# Altium schematic sheet micro-circuit-ATMEGA32M1.SchDoc: ATMega32M1 Circuit
size A4; DrawnBy: Dylan Vogel; Organization: UTAT SS; Revision: 1.0
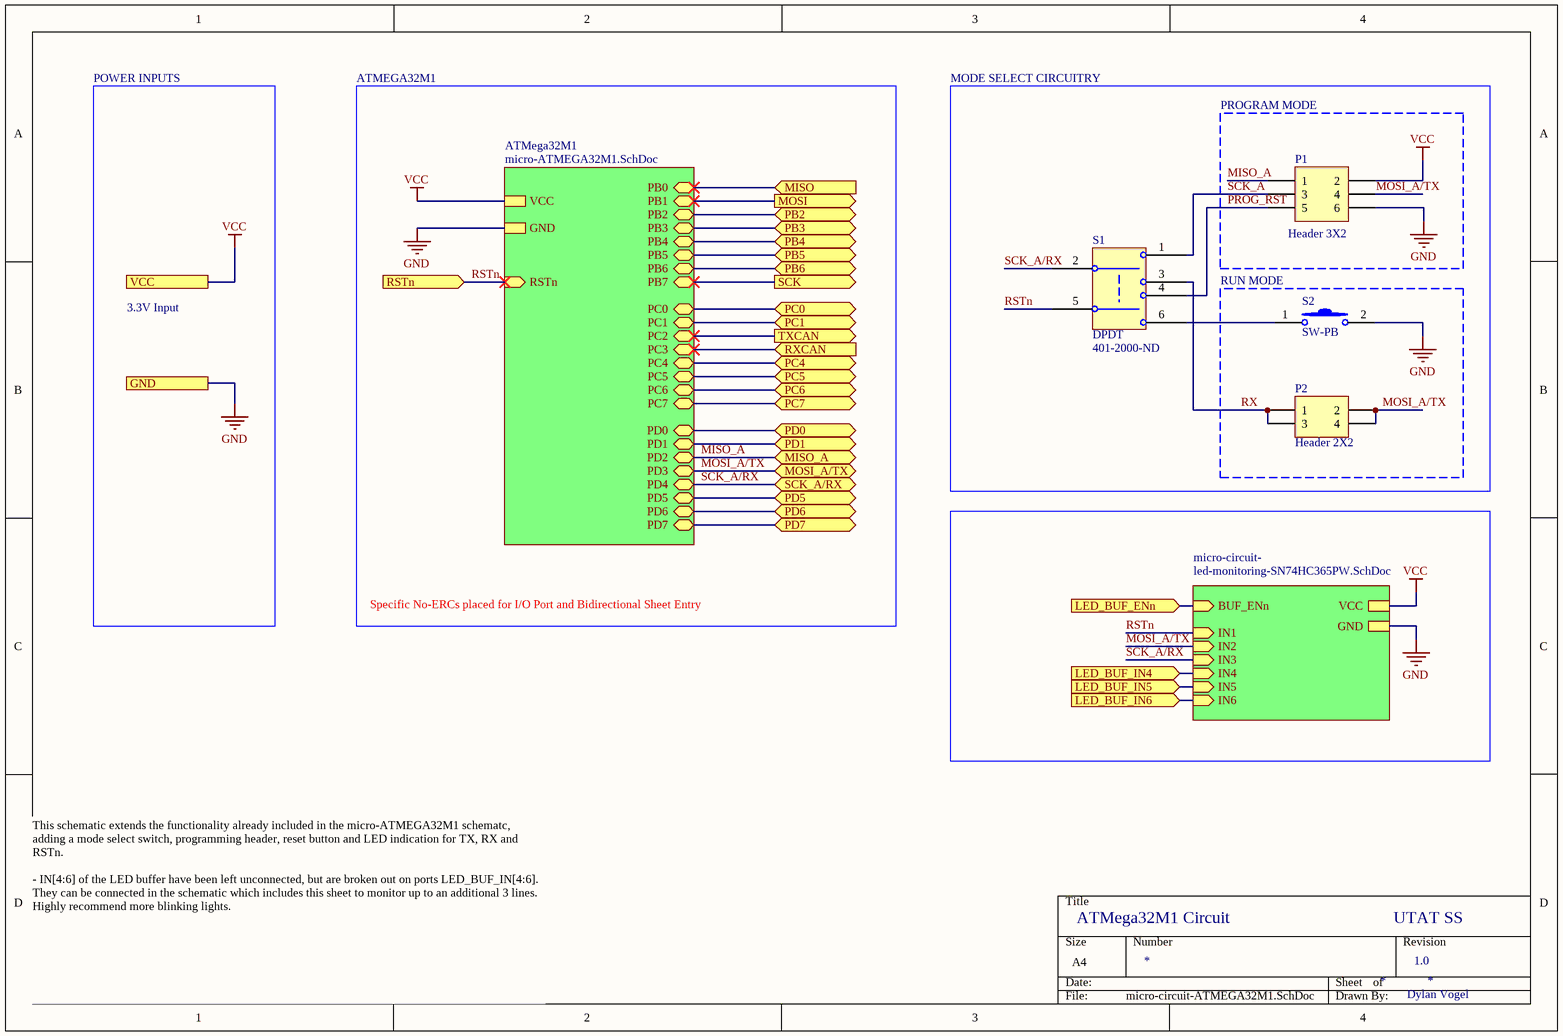
[diagram p0: micro-circuit-ATMEGA32M1.SchDoc]

## Parts
P1  Header 3X2  [HDR2X3]
P2  Header 2X2  [HDR2X2]
S1  DPDT  Supplier Part Number 1: 401-2000-ND  [JS202011AQN - Slide Switch]
S2  SW-PB  [PTS830GM140 SMTR LFS - Pushbutton]

## Blocks framed on the sheet
MODE SELECT CIRCUITRY: S1
PROGRAM MODE: P1
RUN MODE: P2 S2

## Sub-sheets
ATMega32M1 = micro-ATMEGA32M1.SchDoc: GND, PB7 (bidir), RSTn (in), VCC, PD2 (bidir), PC0 (bidir), PD1 (bidir), PD3 (bidir), PD0 (bidir), PC7 (bidir), PD5 (bidir), PC1 (bidir), PC6 (bidir), PB1 (bidir), PB6 (bidir), PC5 (bidir), PC2 (bidir), PB5 (bidir), PC3 (bidir), PD7 (bidir), PB4 (bidir), PB0 (bidir), PC4 (bidir), PD6 (bidir), PB2 (bidir), PB3 (bidir), PD4 (bidir)
micro-circuit- = led-monitoring-SN74HC365PW.SchDoc: IN4 (in), VCC, IN3 (in), IN1 (in), GND, IN2 (in), IN6 (in), IN5 (in), BUF_ENn (in)  | LED1: GREEN LED; LED2: ORANGE LED; LED3: ORANGE LED

## Ports
GND, LED_BUF_ENn (in), LED_BUF_IN4 (in), LED_BUF_IN5 (in), LED_BUF_IN6 (in), MISO (in), MISO_A (bidir), MOSI (out), MOSI_A/TX (bidir), PB2 (bidir), PB3 (bidir), PB4 (bidir), PB5 (bidir), PB6 (bidir), PC0 (bidir), PC1 (bidir), PC4 (bidir), PC5 (bidir), PC6 (bidir), PC7 (bidir), PD0 (bidir), PD1 (bidir), PD5 (bidir), PD6 (bidir), PD7 (bidir), RSTn (in), RXCAN (in), SCK (out), SCK_A/RX (bidir), TXCAN (out), VCC

## Nets
GND: P1.6 S2.2 ; port GND, sheet ATMega32M1/GND, sheet micro-circuit-/GND
VCC: P1.2 ; port VCC, sheet ATMega32M1/VCC, sheet micro-circuit-/VCC
LED_BUF_ENn: port LED_BUF_ENn, sheet micro-circuit-/BUF_ENn
LED_BUF_IN4: port LED_BUF_IN4, sheet micro-circuit-/IN4
LED_BUF_IN5: port LED_BUF_IN5, sheet micro-circuit-/IN5
LED_BUF_IN6: port LED_BUF_IN6, sheet micro-circuit-/IN6
MISO: port MISO, sheet ATMega32M1/PB0
MISO_A: P1.1 ; port MISO_A, sheet ATMega32M1/PD2
MOSI: port MOSI, sheet ATMega32M1/PB1
MOSI_A/TX: P1.4 P2.2 P2.4 ; port MOSI_A/TX, sheet ATMega32M1/PD3, sheet micro-circuit-/IN2
PB2: port PB2, sheet ATMega32M1/PB2
PB3: port PB3, sheet ATMega32M1/PB3
PB4: port PB4, sheet ATMega32M1/PB4
PB5: port PB5, sheet ATMega32M1/PB5
PB6: port PB6, sheet ATMega32M1/PB6
PC0: port PC0, sheet ATMega32M1/PC0
PC1: port PC1, sheet ATMega32M1/PC1
PC4: port PC4, sheet ATMega32M1/PC4
PC5: port PC5, sheet ATMega32M1/PC5
PC6: port PC6, sheet ATMega32M1/PC6
PC7: port PC7, sheet ATMega32M1/PC7
PD0: port PD0, sheet ATMega32M1/PD0
PD1: port PD1, sheet ATMega32M1/PD1
PD5: port PD5, sheet ATMega32M1/PD5
PD6: port PD6, sheet ATMega32M1/PD6
PD7: port PD7, sheet ATMega32M1/PD7
PROG_RST: P1.5 S1.4(POLE2A)
RSTn: S1.5(POLE2) ; port RSTn, sheet ATMega32M1/RSTn, sheet micro-circuit-/IN1
RX: P2.1 P2.3 S1.3(POLE1B)
RXCAN: port RXCAN, sheet ATMega32M1/PC3
SCK: port SCK, sheet ATMega32M1/PB7
SCK_A: P1.3 S1.1(POLE1A)
SCK_A/RX: S1.2(POLE1) ; port SCK_A/RX, sheet ATMega32M1/PD4, sheet micro-circuit-/IN3
TXCAN: port TXCAN, sheet ATMega32M1/PC2
NetS1_6: S1.6(POLE2B) S2.1

## Notes on the sheet
- POWER INPUTS
- ATMEGA32M1
- 3.3V Input
- Specific No-ERCs placed for I/O Port and Bidirectional Sheet Entry
- This schematic extends the functionality already included in the micro-ATMEGA32M1 schematc, adding a mode select switch, programming header, reset button and LED indication for TX, RX and RSTn.
  - IN[4:6] of the LED buffer have been left unconnected, but are broken out on ports LED_BUF_IN[4:6]. They can be connected in the schematic which includes this sheet to monitor up to an additional 3 lines. Highly recommend more blinking lights.

## Library data of the parts
P1 = Header 3X2: Header, 3-Pin, Dual row; LatestRevisionDate: 17-Jul-2002; LatestRevisionNote: Re-released for DXP Platform.; Publisher: Altium Limited
P2 = Header 2X2: Header, 2-Pin, Dual row; LatestRevisionDate: 17-Jul-2002; LatestRevisionNote: Re-released for DXP Platform.; Publisher: Altium Limited
S1 = DPDT Switch: DPDT Switch, customized for the pinout of the JS202011AQN switch.; Supplier 1: Digi-Key
S2 = Pushbutton - Low Profile: Schematic symbol for a generic 2-pin pushbutton, OFF-mom.